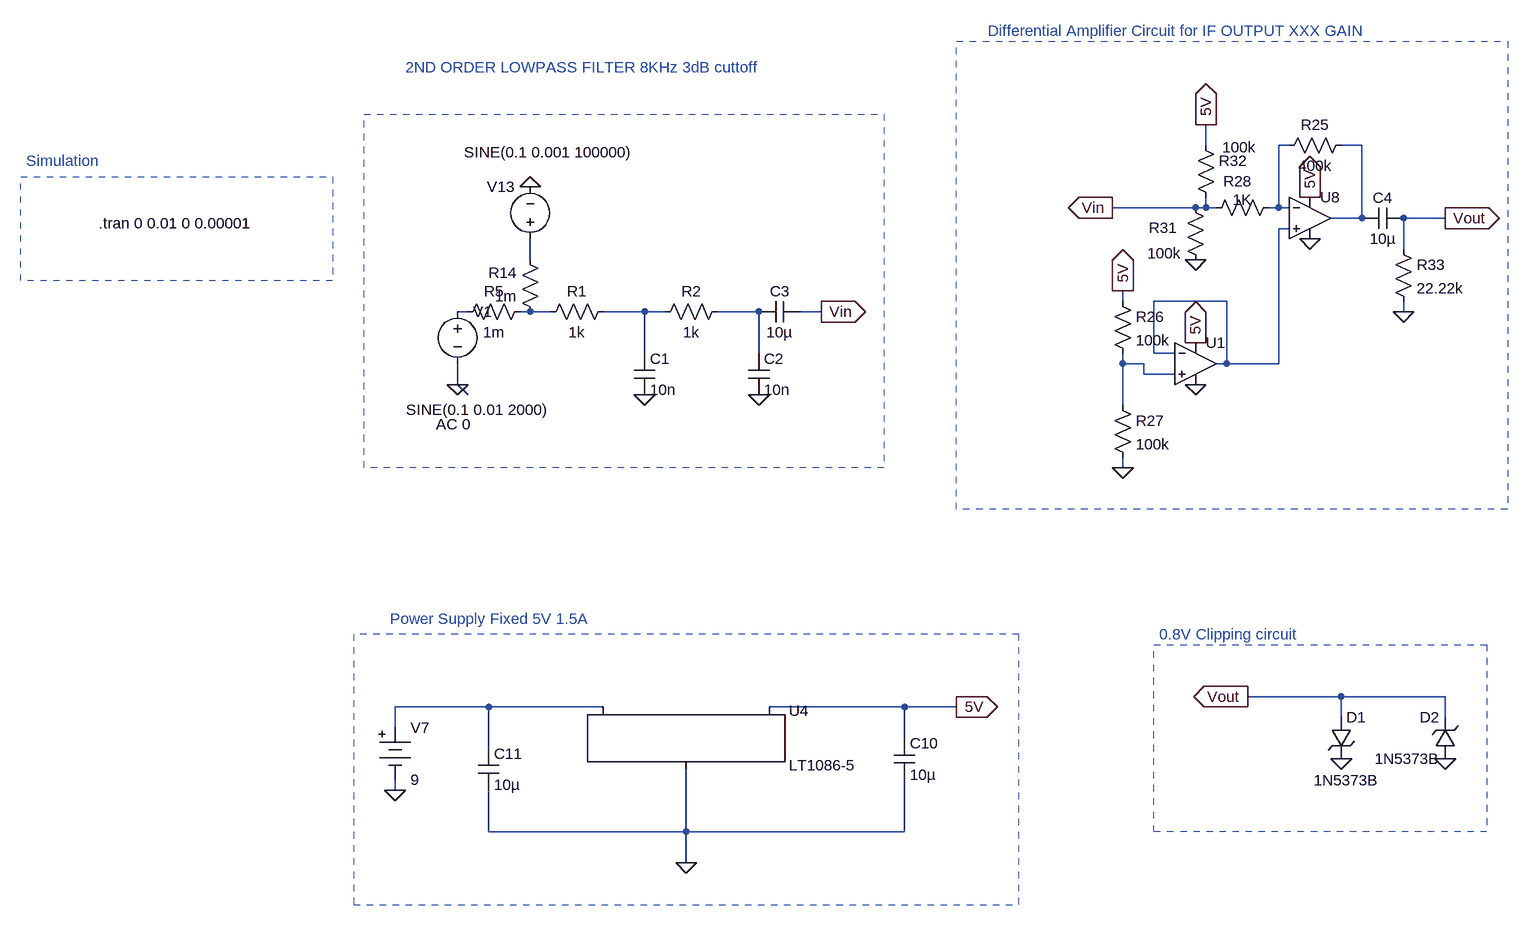
[diagram p0: schematic Skripsie.asc]
Skripsie.asc, the LTspice schematic file:
Version 4
SHEET 1 2904 1380
WIRE 432 -256 432 -288
WIRE 560 -256 544 -256
WIRE 672 -256 640 -256
WIRE 416 -160 288 -160
WIRE 432 -160 432 -176
WIRE 432 -160 416 -160
WIRE 448 -160 432 -160
WIRE 544 -160 544 -256
WIRE 544 -160 528 -160
WIRE 560 -160 544 -160
WIRE 672 -144 672 -256
WIRE 672 -144 624 -144
WIRE 736 -144 720 -144
WIRE 800 -144 736 -144
WIRE 560 -128 544 -128
WIRE 736 -96 736 -144
WIRE -608 -80 -608 -112
WIRE 304 -16 304 -32
WIRE 464 -16 352 -16
WIRE -704 0 -720 0
WIRE -608 0 -624 0
WIRE -576 0 -608 0
WIRE -432 0 -496 0
WIRE -400 0 -432 0
WIRE -256 0 -320 0
WIRE -160 0 -192 0
WIRE 736 0 736 -16
WIRE -432 64 -432 0
WIRE -256 64 -256 0
WIRE 352 64 352 -16
WIRE 384 64 352 64
WIRE 304 80 304 64
WIRE 336 80 304 80
WIRE 464 80 464 -16
WIRE 464 80 448 80
WIRE 544 80 544 -128
WIRE 544 80 464 80
WIRE 336 96 336 80
WIRE 384 96 336 96
WIRE -720 112 -720 80
WIRE -704 128 -720 112
WIRE 304 144 304 80
WIRE 304 240 304 224
WIRE 640 592 496 592
WIRE 800 592 640 592
WIRE -672 608 -816 608
WIRE -496 608 -672 608
WIRE -32 608 -240 608
WIRE 48 608 -32 608
WIRE 640 624 640 592
WIRE 800 624 800 592
WIRE -816 640 -816 608
WIRE -32 656 -32 608
WIRE -672 672 -672 608
WIRE -816 736 -816 720
WIRE -672 800 -672 736
WIRE -368 800 -368 704
WIRE -368 800 -672 800
WIRE -32 800 -32 720
WIRE -32 800 -368 800
WIRE -368 848 -368 800
FLAG -720 112 0
FLAG -368 848 0
FLAG -816 736 0
FLAG 48 608 5V
IOPIN 48 608 Out
FLAG -432 128 0
FLAG -608 -192 0
FLAG -160 0 Vin
IOPIN -160 0 Out
FLAG 304 240 0
FLAG 304 -32 5V
IOPIN 304 -32 Out
FLAG 592 -112 0
FLAG 592 -176 5V
IOPIN 592 -176 Out
FLAG 416 -80 0
FLAG 432 -288 5V
IOPIN 432 -288 Out
FLAG 736 0 0
FLAG 288 -160 Vin
IOPIN 288 -160 Out
FLAG -256 128 0
FLAG 800 -144 Vout
IOPIN 800 -144 Out
FLAG 496 592 Vout
IOPIN 496 592 Out
FLAG 640 688 0
FLAG 800 688 0
FLAG 416 112 0
FLAG 416 48 5V
IOPIN 416 48 Out
SYMBOL voltage -720 -16 R0
WINDOW 3 -79 167 Left 2
WINDOW 123 -33 189 Left 2
WINDOW 39 0 0 Left 0
SYMATTR Value SINE(0.1 0.01 2000)
SYMATTR Value2 AC 0
SYMATTR InstName V1
SYMBOL PowerProducts\\LT1086-5 -368 608 R0
SYMATTR InstName U4
SYMBOL cap -48 656 R0
SYMATTR InstName C10
SYMATTR Value 10µ
SYMBOL cap -688 672 R0
SYMATTR InstName C11
SYMATTR Value 10µ
SYMBOL Misc\\battery -816 624 R0
WINDOW 123 0 0 Left 0
WINDOW 39 0 0 Left 0
SYMATTR InstName V7
SYMATTR Value 9
SYMBOL res -480 -16 R90
WINDOW 0 0 56 VBottom 2
WINDOW 3 32 56 VTop 2
SYMATTR InstName R1
SYMATTR Value 1k
SYMBOL cap -448 64 R0
SYMATTR InstName C1
SYMATTR Value 10n
SYMBOL voltage -608 -96 R180
WINDOW 0 24 96 Left 2
WINDOW 3 -159 149 Left 2
WINDOW 123 0 0 Left 0
WINDOW 39 0 0 Left 0
SYMATTR InstName V13
SYMATTR Value SINE(0.1 0.001 100000)
SYMBOL res -608 -16 R90
WINDOW 0 0 56 VBottom 2
WINDOW 3 32 56 VTop 2
SYMATTR InstName R5
SYMATTR Value 1m
SYMBOL res 656 -272 R90
WINDOW 0 0 56 VBottom 2
WINDOW 3 32 56 VTop 2
SYMATTR InstName R25
SYMATTR Value 400k
SYMBOL res 288 -32 R0
SYMATTR InstName R26
SYMATTR Value 100k
SYMBOL res 288 128 R0
SYMATTR InstName R27
SYMATTR Value 100k
SYMBOL res 544 -176 R90
WINDOW 0 -9 63 VBottom 2
WINDOW 3 -12 56 VTop 2
SYMATTR InstName R28
SYMATTR Value 1K
SYMBOL Opamps\\UniversalOpamp2 592 -144 R0
SYMATTR InstName U8
SYMBOL res 400 -176 R0
WINDOW 0 -56 47 Left 2
WINDOW 3 -58 86 Left 2
SYMATTR InstName R31
SYMATTR Value 100k
SYMBOL res 416 -272 R0
WINDOW 3 41 19 Left 2
SYMATTR Value 100k
SYMATTR InstName R32
SYMBOL res 720 -112 R0
SYMATTR InstName R33
SYMATTR Value 22.22k
SYMBOL res -592 16 R180
WINDOW 0 36 76 Left 2
WINDOW 3 36 40 Left 2
SYMATTR InstName R14
SYMATTR Value 1m
SYMBOL cap -192 -16 R90
WINDOW 0 0 32 VBottom 2
WINDOW 3 32 32 VTop 2
SYMATTR InstName C3
SYMATTR Value 10µ
SYMBOL res -304 -16 R90
WINDOW 0 0 56 VBottom 2
WINDOW 3 32 56 VTop 2
SYMATTR InstName R2
SYMATTR Value 1k
SYMBOL cap -272 64 R0
SYMATTR InstName C2
SYMATTR Value 10n
SYMBOL zener 624 624 R0
WINDOW 3 -26 97 Left 2
SYMATTR Value 1N5373B
SYMATTR InstName D1
SYMATTR Description Diode
SYMATTR Type diode
SYMBOL zener 816 688 R180
WINDOW 0 24 64 Left 2
WINDOW 3 24 0 Left 2
SYMATTR InstName D2
SYMATTR Value 1N5373B
SYMATTR Description Diode
SYMATTR Type diode
SYMBOL cap 736 -160 R90
WINDOW 0 0 32 VBottom 2
WINDOW 3 32 32 VTop 2
SYMATTR InstName C4
SYMATTR Value 10µ
SYMBOL Opamps\\UniversalOpamp2 416 80 R0
SYMATTR InstName U1
TEXT -1272 -136 Left 2 !.tran 0 0.01 0 0.00001
TEXT -800 -376 Left 2 ;2ND ORDER LOWPASS FILTER 8KHz 3dB cuttoff
TEXT 96 -432 Left 2 ;Differential Amplifier Circuit for IF OUTPUT XXX GAIN
TEXT -824 472 Left 2 ;Power Supply Fixed 5V 1.5A
TEXT -1384 -232 Left 2 ;Simulation
TEXT 360 496 Left 2 ;0.8V Clipping circuit
LINE Normal 144 912 144 496 2
LINE Normal -880 912 144 912 2
LINE Normal -880 496 -880 912 2
LINE Normal 144 496 -880 496 2
RECTANGLE Normal -912 -48 -1392 -208 2
RECTANGLE Normal -64 240 -864 -304 2
RECTANGLE Normal 896 304 48 -416 2
RECTANGLE Normal 864 800 352 512 2

The netlist it stands for:
* Skripsie.asc
V1 N005 0 SINE(0.1 0.01 2000) AC 0
XU4 0 5V N010 LT1086-5
C10 5V 0 10µ
C11 N010 0 10µ
V7 N010 0 9
R1 N007 N006 1k
C1 N007 0 10n
V13 N004 0 SINE(0.1 0.001 100000)
R5 N006 N005 1m
R25 N002 N001 400k
R26 5V N009 100k
R27 N009 0 100k
R28 N001 Vin 1K
XU8 N003 N001 5V 0 N002 level.2 Avol=1Meg GBW=10Meg Slew=10Meg ilimit=25m rail=0 Vos=0 phimargin=45 en=0 enk=0 in=0 ink=0 Rin=500Meg  ; pins IN+ IN- V+ V- OUT
R31 Vin 0 100k
R32 5V Vin 100k
R33 Vout 0 22.22k
R14 N006 N004 1m
C3 Vin N008 10µ
R2 N008 N007 1k
C2 N008 0 10n
D1 Vout 0 1N5373B
D2 0 Vout 1N5373B
C4 Vout N002 10µ
XU1 N009 N003 5V 0 N003 level.2 Avol=1Meg GBW=10Meg Slew=10Meg ilimit=25m rail=0 Vos=0 phimargin=45 en=0 enk=0 in=0 ink=0 Rin=500Meg  ; pins IN+ IN- V+ V- OUT
.model D D
.lib standard.dio
.tran 0 0.01 0 0.00001
* 2ND ORDER LOWPASS FILTER 8KHz 3dB cuttoff
* Differential Amplifier Circuit for IF OUTPUT XXX GAIN
* Power Supply Fixed 5V 1.5A
* Simulation
* 0.8V Clipping circuit
.lib UniversalOpamps2.sub
.backanno
.end